# EAGLE design untitled (EAGLE 7.7.0)
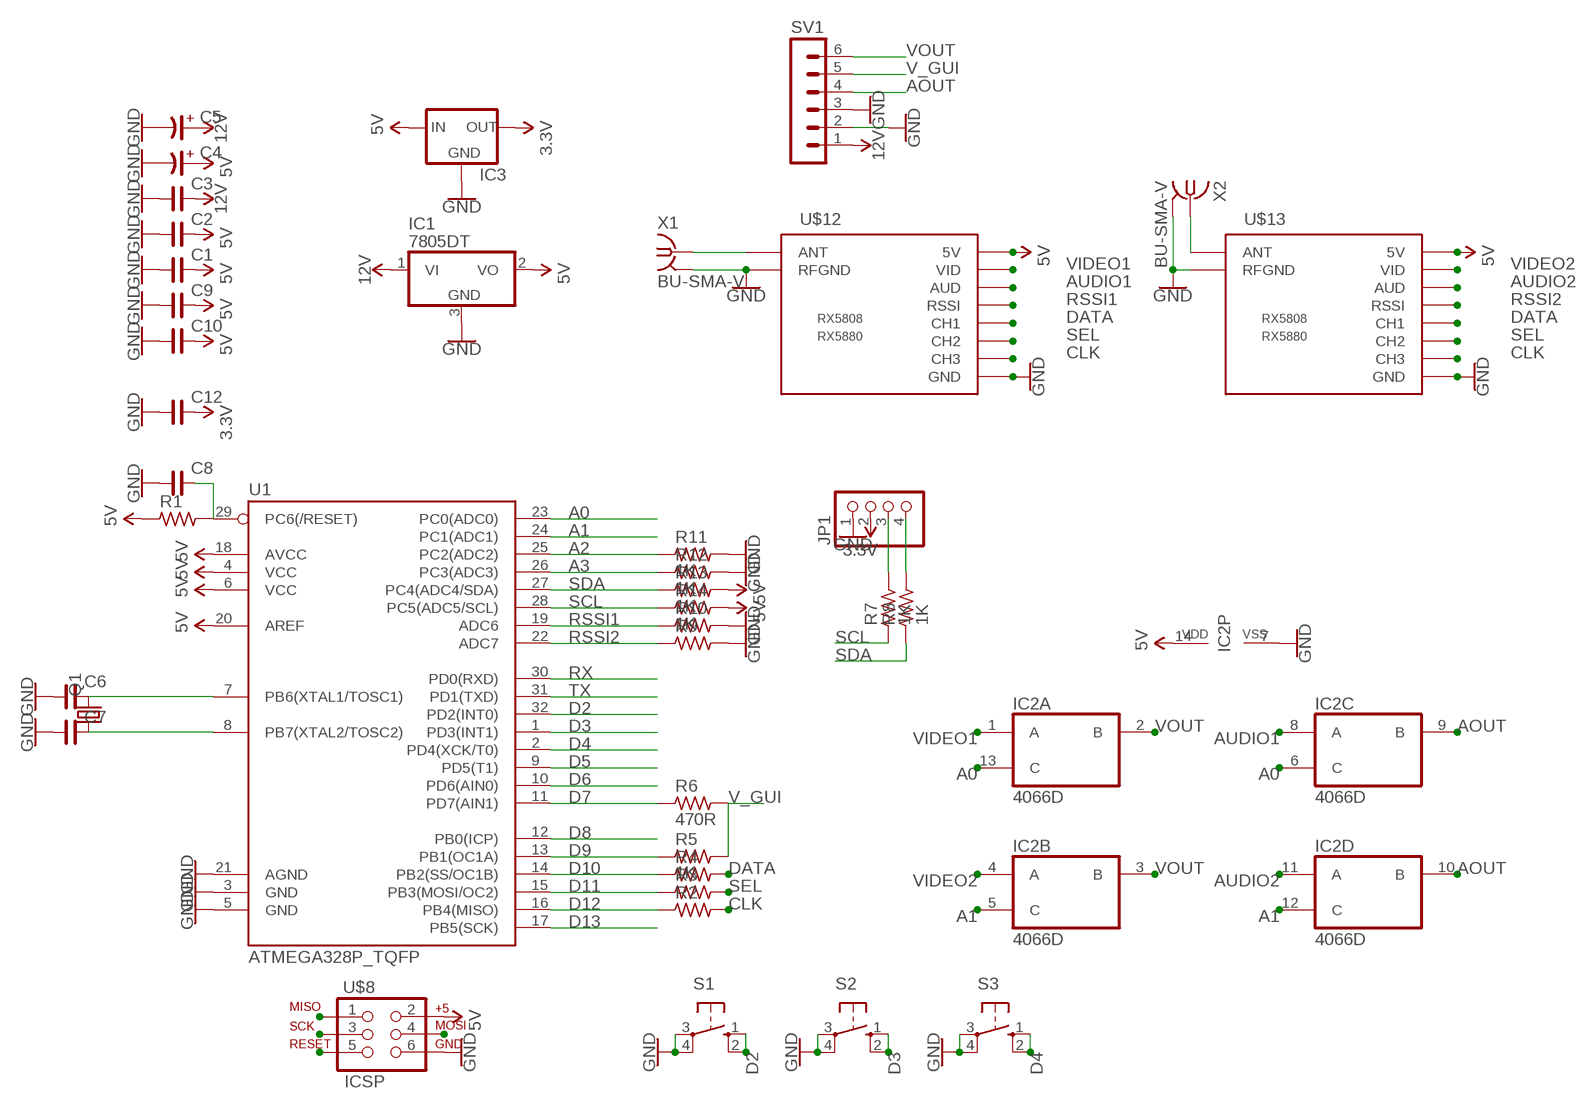
[diagram p0: schematic, sheet 1]

## Parts
C1  C_0805  [C0805]
C2  C_0805  [C0805]
C3  C_0805  [C0805]
C4  CP_6032-28  [C6032-28/T]
C5  CP_6032-28  [C6032-28/T]
C6  C_0805  [C0805]
C7  C_0805  [C0805]
C8  C_0805  [C0805]
C9  C_0805  [C0805]
C10  C_0805  [C0805]
C12  C_0805  [C0805]
IC1  7805DT  [TO252]
IC2  4066D  [SO14]
IC3  LM1117  [SOT223]
JP1  PINHD-1X04_2.54-S  [1X04-S]
Q1  CRYSTALHC49S  [HC49/S]
R1  R_0805  [R0805]
R2  R_0805  [R0805]
R3  R_0805  [R0805]
R4  R_0805  [R0805]
R5  1K  R_0805  [R0805]
R6  470R  R_0805  [R0805]
R7  1K  R_0805  [R0805]
R8  1K  R_0805  [R0805]
R9  R_0805  [R0805]
R10  R_0805  [R0805]
R11  1K  R_0805  [R0805]
R12  1K  R_0805  [R0805]
R13  1K  R_0805  [R0805]
R14  1K  R_0805  [R0805]
S1  10-XX  [B3F-10XX]
S2  10-XX  [B3F-10XX]
S3  10-XX  [B3F-10XX]
SV1  MA06-1  [MA06-1]
U1  ATMEGA328P_TQFP  [TQFP32-08]
U$8  ICSP  AVR_SPI_PRG_6NS  [2X3-NS]
U$12  RX5808  [RX5808]
U$13  RX5808  [RX5808]
X1  BU-SMA-V  [BU-SMA-V]
X2  BU-SMA-V  [BU-SMA-V]

## Nets
3.3V: C12.2 IC3.2(OUT) JP1.2
5V: C1.2 C2.2 C4.+ C9.2 C10.2 IC1.2(VO) IC2.14(P:VDD) IC3.3(IN) R1.1 R13.2 R14.2 U1.4(VCC) U1.6(VCC) U1.18(AVCC) U1.20(AREF) U$8.2 U$12.VCC(5V) U$13.VCC(5V)
12V: C3.2 C5.+ IC1.1(VI) SV1.1
A0: IC2.6(C:C) IC2.13(A:C) U1.23(PC0(ADC0))
A1: IC2.5(B:C) IC2.12(D:C) U1.24(PC1(ADC1))
A2: R11.1 U1.25(PC2(ADC2))
A3: R12.1 U1.26(PC3(ADC3))
AOUT: IC2.9(C:B) IC2.10(D:B) SV1.4
AUDIO1: IC2.8(C:A) U$12.AUD
AUDIO2: IC2.11(D:A) U$13.AUD
CLK: R2.2 U$12.CH3 U$13.CH3
D2: S1.1(S) S1.2(S1) U1.32(PD2(INT0))
D3: S2.1(S) S2.2(S1) U1.1(PD3(INT1))
D4: S3.1(S) S3.2(S1) U1.2(PD4(XCK/T0))
D5: U1.9(PD5(T1))
D6: U1.10(PD6(AIN0))
D7: R6.1 U1.11(PD7(AIN1))
D8: U1.12(PB0(ICP))
D9: R5.1 U1.13(PB1(OC1A))
D10: R4.1 U1.14(PB2(SS/OC1B))
D11: R3.1 U1.15(PB3(MOSI/OC2)) U$8.4
D12: R2.1 U1.16(PB4(MISO)) U$8.1
D13: U1.17(PB5(SCK)) U$8.3
DATA: R4.2 U$12.CH1 U$13.CH1
GND: C1.1 C2.1 C3.1 C4.- C5.- C6.1 C7.1 C8.1 C9.1 C10.1 C12.1 IC1.3(GND) IC2.7(P:VSS) IC3.1(GND) JP1.1 R9.2 R10.2 R11.2 R12.2 S1.3(P) S1.4(P1) S2.3(P) S2.4(P1) S3.3(P) S3.4(P1) SV1.2 SV1.3 U1.3(GND) U1.5(GND) U1.21(AGND) U$8.6 U$12.GND@1(GND) U$12.GND@2(GND) U$12.RFGND@1(RFGND) U$12.RFGND@2(RFGND) U$13.GND@1(GND) U$13.GND@2(GND) U$13.RFGND@1(RFGND) U$13.RFGND@2(RFGND) X1.2 X1.3 X1.4 X1.5 X2.2 X2.3 X2.4 X2.5
N$1: JP1.3 R7.2
N$2: C6.2 Q1.2 U1.7(PB6(XTAL1/TOSC1))
N$3: C7.2 Q1.1 U1.8(PB7(XTAL2/TOSC2))
N$4: JP1.4 R8.2
N$5: U$12.ANT X1.1
N$7: U$13.ANT X2.1
RSSI1: R10.1 U1.19(ADC6) U$12.RSSI
RSSI2: R9.1 U1.22(ADC7) U$13.RSSI
RST: C8.2 R1.2 U1.29(PC6(/RESET)) U$8.5
RX: U1.30(PD0(RXD))
SCL: R7.1 R14.1 U1.28(PC5(ADC5/SCL))
SDA: R8.1 R13.1 U1.27(PC4(ADC4/SDA))
SEL: R3.2 U$12.CH2 U$13.CH2
TX: U1.31(PD1(TXD))
V_GUI: R5.2 R6.2 SV1.5
VIDEO1: IC2.1(A:A) U$12.VID
VIDEO2: IC2.4(B:A) U$13.VID
VOUT: IC2.2(A:B) IC2.3(B:B) SV1.6

## Library data of the parts
C1-C3 C6-C10 C12 = Acap_BNM:C_: NON-POLARIZED CAP
C4 C5 = Acap_BNM:CP_: POLARIZED CAP
IC1 = gm-regulators:78*: Positive VOLTAGE REGULATOR Source: http://cache.national.com/ds/LM/LM78L05.pdf http://www.fairchildsemi.com/ds/LM/LM7805.pdf
IC2 = 40xx:4066: Quad bilateral ANALOG SWITCH
IC3 = v-reg-3:LM1117
JP1 = pinhead-2:PINHD-1X04: PIN HEADER
Q1 = adafruit:CRYSTAL: CRYSTAL; OC_FARNELL: 1667008; OC_NEWARK: unknown
R1-R14 = Acap_BNM:R_: RESISTOR
S1-S3 = switch-omron:10-XX: OMRON SWITCH; MPN: B3F-1000; OC_FARNELL: 176432; OC_NEWARK: 36M3542
SV1 = con-lstb:MA06-1: PIN HEADER; OC_FARNELL: unknown; OC_NEWARK: unknown
U1 = SparkFun-IC-Microcontroller:ATMEGA328P_TQFP: Popular 328P in QFP Storefront component: ATmega328 - TQFP <https://www.sparkfun.com/products/13448> (COM-13448) Datasheet <http://www.sparkfun.com/datasheets/Components/SMD/ATMega328.pdf> SparkFun Products SparkFun RedBoard - Programmed with Arduino <https://www.sparkfun.com/products/12757> (DEV-12757) Arduino Pro Mini 328 - 5V/16MHz <https://www.sparkfun.com/products/11113> (DEV-11113) Arduino Pro Mini 328 - 3.3V/8MHz <https://www.sparkfun.com/products/11114> (DEV-11114) SparkFun OpenLog <https://www.sparkfun.com/products/13712> (DEV-13712) SparkFun MicroView - OLED Arduino Module <https://www.sparkfun.com/products/12923> (DEV-12923) SparkFun Digital Sandbox <https://www.sparkfun.com/products/12651> (DEV-12651) SparkFun PicoBoard <https://www.sparkfun.com/products/11888> (WIG-11888) Arduino Fio <https://www.sparkfun.com/products/10116> (DEV-10116) LilyPad Arduino 328 Main Board <https://www.sparkfun.com/products/13342> (DEV-13342) SparkFun RedStick <https://www.sparkfun.com/products/13741> (DEV-13741) LilyPad MP3 <https://www.sparkfun.com/products/11013> (DEV-11013) LilyPad Arduino SimpleSnap <https://www.sparkfun.com/products/10941> (DEV-10941) SparkFun Stepoko <https://www.sparkfun.com/products/13899> (ROB-13899) SparkFun Geiger Counter <https://www.sparkfun.com/products/11345> (SEN-11345) SparkFun EL Sequencer <https://www.sparkfun.com/products/12781> (COM-12781) Arduino Pro 328 - 5V/16MHz <https://www.sparkfun.com/products/10915> (DEV-10915) CryptoCape <https://www.sparkfun.com/products/12773> (DEV-12773) SparkFun IR Thermometer Evaluation Board - MLX90614 <https://www.sparkfun.com/products/10740> (SEN-10740) SparkFun RedBot Mainboard <https://www.sparkfun.com/products/12097> (ROB-12097) Arduino Pro 328 - 3.3V/8MHz <https://www.sparkfun.com/products/10914> (DEV-10914) SparkFun Block for Intel® Edison - Arduino <https://www.sparkfun.com/products/13036> (DEV-13036) SparkFun Simon Says - Surface Mount Soldering Kit <https://www.sparkfun.com/products/10935> (KIT-10935) SparkFun 7-Segment Serial Display - Red <https://www.sparkfun.com/products/11441> (COM-11441) SparkFun 7-Segment Serial Display - White <https://www.sparkfun.com/products/11629> (COM-11629) SparkFun 7-Segment Serial Display - Yellow <https://www.sparkfun.com/products/11443> (COM-11443) SparkFun 7-Segment Serial Display - Kelly Green <https://www.sparkfun.com/products/11440> (COM-11440) SparkFun 7-Segment Serial Display - Blue <https://www.sparkfun.com/products/11442> (COM-11442) SparkFun OpenSegment Serial Display - 20mm (Blue) <https://www.sparkfun.com/products/11647> (COM-11647) SparkFun OpenSegment Serial Display - 20mm (Green) <https://www.sparkfun.com/products/11646> (COM-11646) SparkFun OpenSegment Serial Display - 20mm (White) <https://www.sparkfun.com/products/11648> (COM-11648) SparkFun OpenSegment Serial Display - 20mm (Red) <https://www.sparkfun.com/products/11644> (COM-11644) SparkFun OpenSegment Serial Display - 20mm (Yellow) <https://www.sparkfun.com/products/11645> (COM-11645) SparkFun OpenSegment Shield <https://www.sparkfun.com/products/13190> (DEV-13190); PROD_ID: IC-09069
U$8 = SparkFun:AVR_SPI_PRG_6: AVR ISP 6 Pin This is the reduced ISP connector for AVR programming. Common on Arduino. This footprint will take up less PCB space and can be used with a 10-pin to 6-pin adapter such as SKU: BOB-08508
U$12 U$13 = 5G8_fpv:RX5808
X1 X2 = con-coax:BU-SMA-V: FEMALE SMA CONNECTOR Radiall distributor RS 112-3794; OC_FARNELL: unknown; OC_NEWARK: unknown

## Board
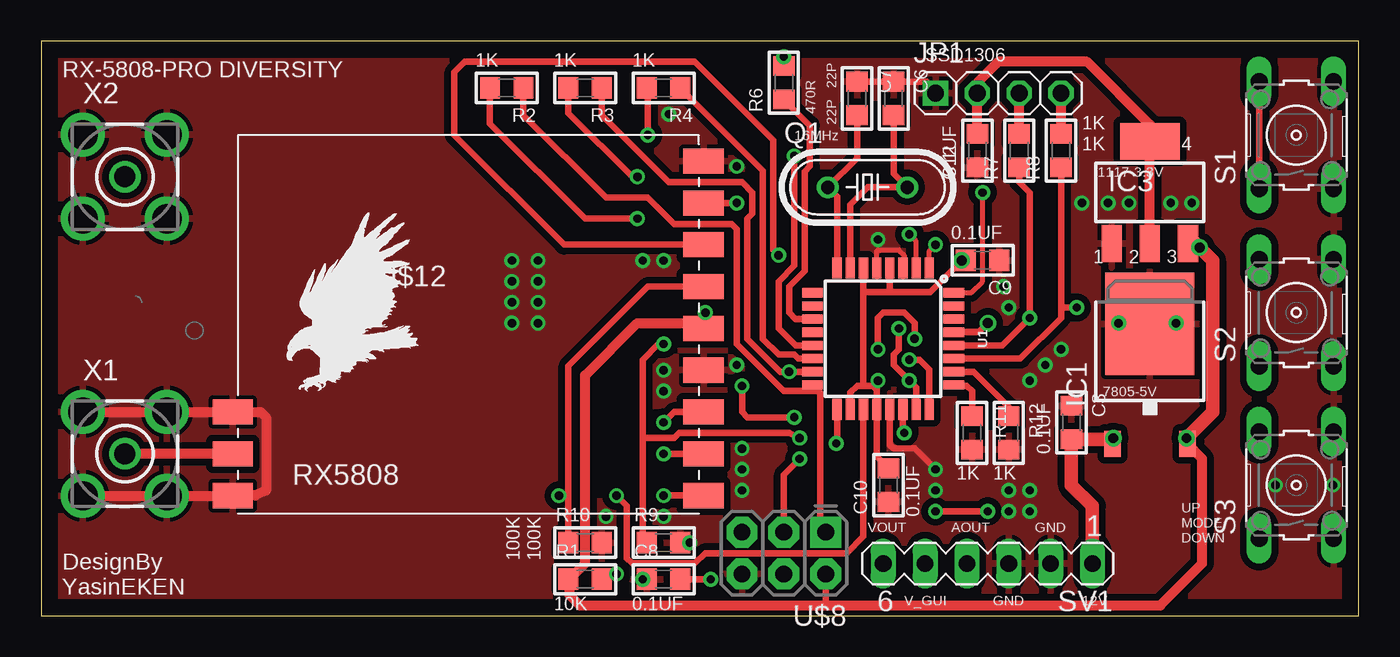
[diagram p1: board, top side]
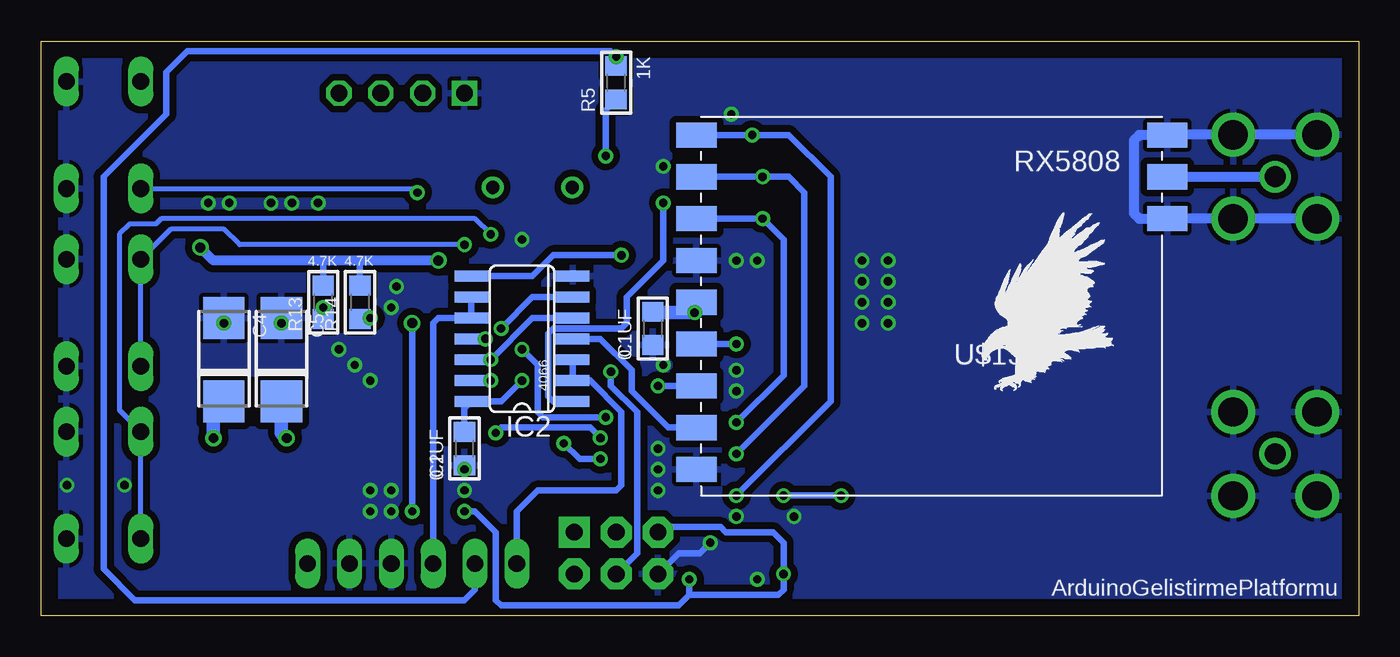
[diagram p2: board, bottom side, seen from below]

Size 79.99 x 34.91 mm. Coordinates in mm from the lower left corner, seen from the top.
Outline: 0,0 79.99,0 79.99,34.91 0,34.91 0,0
Copper layers (1*16): Top 0.035mm / dielectric 1.5mm / Bottom 0.035mm
Design rules "default": minimum track width 10mil, minimum drill 24mil, track to track 8mil, track to pad 8mil, pad to pad 8mil, via to via 8mil, smd to smd 8mil, copper to edge 40mil, drill to drill 8mil, minimum pad ring 10mil, minimum via ring 8mil, stop-mask expansion 4mil, vias tented up to drill 0mil, thermal gap 10mil

### Footprints (pad centres in the part's own frame; a part is rotated, then mirrored left to right if it is on the bottom)
C0805 = smd 1.2 x 1.3: 1 -1.016,0; 2 1.016,0
C6032-28/T = smd 2.55 x 2.5: + 2.54,0; - -2.54,0
TO252 = smd 1 x 1.6: 1 -2.28,-4.8; 2 2.28,-4.8 | smd 5.4 x 6.2: 3 0,2.5
SO14 = smd 0.66 x 2.032: 1 -3.81,-3.073; 2 -2.54,-3.073; 3 -1.27,-3.073; 4 0,-3.073; 5 1.27,-3.073; 6 2.54,-3.073; 7 3.81,-3.073; 8 3.81,3.073; 9 2.54,3.073; 10 1.27,3.073; 11 0,3.073; 12 -1.27,3.073; 13 -2.54,3.073; 14 -3.81,3.073
SOT223 = smd 1.219 x 2.235: 1 -2.311,-3.099; 2 0,-3.099; 3 2.311,-3.099 | smd 3.6 x 2.2: 4 0,3.099
1X04-S = drill 1.016 square: 1 -3.81,0 | drill 1.016 octagon: 2 -1.27,0; 3 1.27,0; 4 3.81,0
HC49/S = drill 0.813: 1 -2.413,0; 2 2.413,0
R0805 = smd 1.2 x 1.3: 1 -1.016,0; 2 1.016,0
B3F-10XX = drill 1.016 long: 1 -3.251,2.261; 2 3.251,2.261; 3 -3.251,-2.261; 4 3.251,-2.261
MA06-1 = drill 1.016 long: 1 -6.35,0; 2 -3.81,0; 3 -1.27,0; 4 1.27,0; 5 3.81,0; 6 6.35,0
TQFP32-08 = smd 1.27 x 0.559: 1 -4.293,2.8; 2 -4.293,2; 3 -4.293,1.2; 4 -4.293,0.4; 5 -4.293,-0.4; 6 -4.293,-1.2; 7 -4.293,-2; 8 -4.293,-2.8; 17 4.293,-2.8; 18 4.293,-2; 19 4.293,-1.2; 20 4.293,-0.4; 21 4.293,0.4; 22 4.293,1.2; 23 4.293,2; 24 4.293,2.8 | smd 0.559 x 1.27: 9 -2.8,-4.293; 10 -2,-4.293; 11 -1.2,-4.293; 12 -0.4,-4.293; 13 0.4,-4.293; 14 1.2,-4.293; 15 2,-4.293; 16 2.8,-4.293; 25 2.8,4.293; 26 2,4.293; 27 1.2,4.293; 28 0.4,4.293; 29 -0.4,4.293; 30 -1.2,4.293; 31 -2,4.293; 32 -2.8,4.293
2X3-NS = drill 1.016 pad 1.88 square: 1 -2.54,-1.27 | drill 1.016 pad 1.88 octagon: 2 -2.54,1.27; 3 0,-1.27; 4 0,1.27; 5 2.54,-1.27; 6 2.54,1.27
RX5808 = smd 2.438 x 1.524: ANT -15.037,-7.62; AUD 13.538,5.08; CH1 13.538,-10.16; CH2 13.538,-7.62; CH3 13.538,-5.08; GND@1 13.538,10.16; GND@2 13.538,-2.54; RFGND@1 -15.037,-5.08; RFGND@2 -15.037,-10.16; RSSI 13.538,2.54; VCC 13.538,0; VID 13.538,7.62
BU-SMA-V = drill 1.27: 1 0,0 | drill 1.778: 2 -2.55,2.55; 3 2.55,2.55; 4 2.55,-2.55; 5 -2.55,-2.55

### Placement (x,y rotation side)
C1  42.86,17.46 90 bottom
C2  54.29,10.16 90 bottom
C3  62.55,11.75 270 top
C4  68.9,15.56 270 bottom
C5  65.41,15.56 270 bottom
C6  51.75,31.43 270 top
C7  49.53,31.43 270 top
C8  37.78,2.22 0 top
C9  57.15,21.59 180 top
C10  51.44,7.94 90 top
C12  56.83,28.26 90 top
IC1  67.31,15.24 0 top
IC2  50.8,16.83 90 bottom
IC3  67.31,25.72 0 top
JP1  58.1,31.75 0 top
Q1  50.16,26.04 0 top
R1  33.02,2.22 0 top
R2  28.26,32.07 180 top
R3  33.02,32.07 180 top
R4  37.78,32.07 180 top
R5  45.09,32.38 90 bottom
R6  45.09,32.38 90 top
R7  59.37,28.26 90 top
R8  61.91,28.26 90 top
R9  37.78,4.45 0 top
R10  33.02,4.45 0 top
R11  56.52,11.11 270 top
R12  58.74,11.11 270 top
R13  62.87,19.05 90 bottom
R14  60.64,19.05 90 bottom
S1  76.2,29.21 90 top
S2  76.2,18.41 90 top
S3  76.2,7.94 90 top
SV1  57.47,3.17 180 top
U1  51.12,16.83 270 top
U$8  45.09,3.81 180 top
U$10  [LOGO]  1.91,16.83 0 top
U$12  26.67,17.46 0 top
U$13  26.67,19.05 180 bottom
U$19  [EAGLE-PLC-8MM]  14.92,13.65 0 top
U$20  [EAGLE-PLC-8MM]  22.86,13.65 0 bottom
X1  5.08,9.84 0 top
X2  5.08,26.67 0 top

### Tracks (layer width: path | path; a pad name or v marks a point on that pad's centre or on a via)
3.3V
  Top 0.61: IC3.2 67.31,29.84 63.5,33.66 58.1,33.66 56.83,32.38 JP1.2 | C12.2 JP1.2 | JP1.2 56.83,31.91
5V  (via drill 0.5, 0.6)
  Top 0.406: U1.20 50.72,13.73 50.48,13.97 49.92,13.97 | 49.92,13.97 49.53,13.97 49.12,13.56 U1.18 | U1.6 49.92,19.68 | 49.92,19.68 49.92,13.97 | C10.2 50.72,9.67 U1.20 | C9.2 56.13,21.65 | v50.8,14.29 50.72,14.21 U1.20 | 32.07,2.22 R1.1 | U$8.2 47.62,0.64 | 55.94,21.65 53.98,19.68 51.44,19.68 | 51.44,19.68 49.92,19.68 | U1.4 51.52,19.77 51.44,19.68
  Top 0.61: 69.53,22.53 IC3.3 69.86,22.38 v70.33,22.38 | v55.88,21.59 C9.2 | 56.13,21.65 55.94,21.65 | IC1.2 70.48,9.54 70.48,3.17 67.94,0.64 47.62,0.64 32.7,0.64 32.07,1.27 32.07,2.22 33.02,3.17 33.02,14.61 36.2,17.78 39.69,17.78 40.01,17.46 U$12.VCC
  Top 0.813: U$12.VCC 40.32,17.58 v40.32,18.41 | IC1.2 69.59,10.74 v69.53,10.79 71.12,12.38 71.12,21.59 v70.33,22.38 70.09,22.62 IC3.3
  Bottom 0.406: v50.8,14.29 52.07,13.02 IC2.14 54.29,12.6 C2.2 | R14.2 60.64,21.59 | R13.2 62.87,21.59
  Bottom 0.61: v55.88,21.59 60.64,21.59 62.87,21.59 69.53,21.59 v70.33,22.38
  Bottom 0.813: U$13.VCC 40.21,18.53 v40.32,18.41 42.8,18.41 C1.2 | v69.53,10.79 69.53,12.38 C4.+
12V  (via drill 0.6)
  Top 0.813: SV1.1 63.82,6.67 62.55,7.94 C3.2 65,10.73 IC1.1 65.09,10.18 v65.09,10.79
  Bottom 0.813: C5.+ 65.41,11.11 v65.09,10.79
A0  (via drill 0.5)
  Top 0.406: U1.23 53.12,13.88 v52.7,14.29 51.75,15.24 51.75,15.88 52.07,16.19 v52.07,17.46
  Bottom 0.406: v52.7,14.29 IC2.13 | IC2.6 50.16,19.37 v52.07,17.46
A1  (via drill 0.5)
  Top 0.406: U1.24 53.92,14.98 53.34,15.56 v52.7,15.56
  Bottom 0.406: IC2.12 v52.7,15.56 50.16,18.1 IC2.5
A2
  Top 0.406: R11.1 56.52,13.65 56.2,13.97 55.47,13.97 U1.25
A3
  Top 0.406: R12.1 58.74,12.7 56.61,14.83 U1.26
AOUT
  Bottom 0.406: IC2.9 IC2.10 55.88,18.1 56.2,17.78 SV1.4
AUDIO1  (via drill 0.5)
  Top 0.406: U$12.AUD 31.75,22.54 25.08,29.21 25.08,33.02 25.72,33.66 39.69,33.66 44.45,28.89 44.45,22.23 v44.77,21.91
  Bottom 0.406: IC2.8 50.16,20.64 48.9,21.91 v44.77,21.91
AUDIO2  (via drill 0.5)
  Top 0.406: v53.02,16.83 53.02,17.78 52.39,18.41 51.12,18.41 50.8,18.1 v50.8,16.19 | v42.55,13.97 42.55,12.38 42.86,12.06 v45.72,12.06
  Bottom 0.406: IC2.11 v53.02,16.83 | v50.8,16.19 49.85,15.24 49.85,12.38 49.53,12.06 v45.72,12.06 | U$13.AUD v42.55,13.97
CLK  (via drill 0.5)
  Top 0.406: R2.2 27.24,29.91 33.02,24.13 v36.2,24.13 | U$12.CH3 38.42,12.38 v37.78,11.75
  Bottom 0.406: U$13.CH3 v36.2,24.13 34.92,22.86 34.92,14.61 v37.78,11.75
D2  (via drill 0.5)
  Top 0.305: U1.32 56.46,19.63 57.15,20.32 v57.15,25.72
  Top 0.406: S1.2 S1.1
  Bottom 0.305: S1.1 57.39,25.96 v57.15,25.72
D3  (via drill 0.5)
  Top 0.305: U1.1 53.92,22.17 v54.29,22.54
  Bottom 0.305: v54.29,22.54 67.94,22.54 68.9,23.5 72.11,23.5 S2.2 S2.1
D4  (via drill 0.5)
  Top 0.305: U1.2 53.12,22.77 v52.7,23.18
  Bottom 0.305: v52.7,23.18 53.66,24.13 72.71,24.13 73.03,23.81 74.61,23.81 75.25,23.18 75.25,12.5 S3.2 S3.1
D7
  Top 0.406: U1.11 45.79,18.03 45.4,18.41 45.4,20 46.35,20.95 46.35,26.99 46.67,27.3 46.67,29.78 R6.1
D9  (via drill 0.5)
  Top 0.406: U1.13 45.8,16.43 44.77,17.46 44.77,20.32 45.72,21.27 v45.72,27.94
  Bottom 0.406: v45.72,27.94 45.72,30.73 R5.1
D10
  Top 0.406: R4.1 43.81,27.05 43.81,16.83 44.77,15.88 45.72,15.88 45.97,15.63 U1.14
D11  (via drill 0.5)
  Top 0.406: U1.15 v45.4,14.83 44.86,14.83 42.86,16.83 42.86,24.13 43.18,24.45 43.18,25.72 42.55,26.35 38.1,26.35 34.04,30.42 R3.1
  Bottom 0.406: v45.4,14.83 45.4,13.97 43.81,12.38 43.81,3.81 U$8.4
D12
  Top 0.406: R2.1 29.27,30.42 34.29,25.4 36.83,25.4 38.42,23.81 41.91,23.81 42.23,23.5 42.23,16.51 45.09,13.65 47.2,13.65 | U$8.1 47.31,5.4 47.31,13.54 47.2,13.65 | 47.2,13.65 U1.16
D13  (via drill 0.5)
  Top 0.406: U$8.3 45.09,8.57 v46.04,9.53 | v48.26,10.48 48.32,10.54 U1.17
  Bottom 0.406: v46.04,9.53 47.31,9.53 v48.26,10.48
DATA  (via drill 0.5)
  Top 0.406: U$12.CH1 v37.78,7.3 | R4.2 36.83,32 v36.83,29.21
  Bottom 0.406: U$13.CH1 v36.83,29.21 34.61,29.21 32.07,26.67 32.07,13.02 v37.78,7.3
GND  (via drill 0.5)
  Top 0.305: U1.5 50.72,22.14 50.8,22.23 52.07,22.23 52.39,21.91 52.39,21.19 U1.3
  Top 0.406: C7.1 C6.1 53.75,32.45 | U1.21 51.52,10.39 51.75,10.16 53.02,10.16 v54.29,8.89 | v39.37,4.45 R9.2
  Top 0.61: X1.2 X1.3 11.62,12.39 U$12.RFGND@1 13.34,12.38 13.65,12.06 13.65,7.62 13.02,7.3 U$12.RFGND@2 X1.4 X1.5
  Bottom 0.406: U$8.6 41.27,3.81 40.01,3.81 v39.37,4.45
  Bottom 0.61: X2.2 X2.3 U$13.RFGND@2 13.34,29.21 13.65,28.89 13.65,24.45 13.34,24.13 U$13.RFGND@1 X2.4 X2.5
  other vias: 65.41,17.78 68.9,17.78 74.93,7.94 78.42,7.94 37.78,14.92 37.78,13.65 42.23,15.24 42.55,8.89 42.55,10.16 42.55,7.62 36.51,2.22 34.29,6.03 37.78,21.59 36.51,21.59 38.1,30.48 42.23,27.3 60.96,15.24 63.18,25.08 66.04,25.08 68.58,25.08 69.85,25.08 64.77,25.08 58.42,20 54.29,7.62 30.16,21.59 30.16,20.32 30.16,19.05 30.16,17.78 28.57,17.78 28.57,19.05 28.57,20.32 28.57,21.59 37.78,6.03 58.74,18.73 60.01,6.35 60.01,14.29 61.91,16.19 60.01,7.62 58.74,7.62 58.74,6.35 50.8,22.86
  pour Bottom (isolate 0.406): 0,0 80.01,0 80.01,34.92 0,34.92
  pour Top (isolate 0.406): 0,0 80.01,0 80.01,34.92 0,34.92
N$1
  Top 0.61: R7.2 JP1.3
N$2
  Top 0.406: U1.7 49.12,24.99 50.16,26.04 Q1.2 51.75,26.86 C6.2
N$3
  Top 0.406: U1.8 48.32,25.47 Q1.1 49.53,27.81 C7.2
N$4
  Top 0.61: R8.2 JP1.4
N$5
  Top 0.61: U$12.ANT X1.1
N$7
  Bottom 0.61: U$13.ANT X2.1
RSSI1  (via drill 0.5)
  Top 0.406: R10.1 32,7.3 | 32,7.3 32,15.18 36.83,20 U$12.RSSI | U1.19 49.92,4.83 48.9,3.81 40.32,3.81 39.69,3.17 35.88,3.17 35.56,3.49 35.56,6.67 v34.92,7.3 | v31.43,7.3 32,7.3
  Bottom 0.406: v34.92,7.3 v31.43,7.3
RSSI2  (via drill 0.5)
  Top 0.406: R9.1 36.51,4.7 36.51,10.79 | 36.51,10.79 36.51,15.56 37.47,16.51 v37.78,16.51 | U1.22 52.32,11.18 v52.39,11.11 | v46.04,10.79 45.4,11.11 38.73,11.11 38.42,10.79 36.51,10.79
  Bottom 0.406: v37.78,16.51 U$13.RSSI | v52.39,11.11 52.07,11.43 46.67,11.43 v46.04,10.79
RST  (via drill 0.5, 0.6)
  Top 0.406: U1.29 56.91,17.23 v57.47,17.78 | C8.2 v40.64,2.22 | R1.2 v34.92,2.54 | v57.47,6.35 v54.29,6.35
  Bottom 0.406: 40.64,1.27 v40.64,2.22 | 40.64,1.27 35.24,1.27 34.92,1.59 v34.92,2.54 34.92,4.45 35.56,5.08 38.42,5.08 38.73,5.4 42.23,5.4 U$8.5 | v57.47,17.78 v57.47,6.35 | v54.29,6.35 53.66,6.35 52.39,5.08 52.39,0.95 52.07,0.64 41.27,0.64 40.64,1.27
SCL  (via drill 0.5)
  Top 0.406: U1.28 58.34,16.43 v60.01,18.1 60.01,25.72 59.37,26.35 R7.1
  Bottom 0.406: R14.1 60.9,18.1 v60.01,18.1
SDA  (via drill 0.5)
  Top 0.406: U1.27 59.44,15.63 61.91,18.1 61.91,18.73 | 61.91,18.73 R8.1 | v62.87,18.73 61.91,18.73
  Bottom 0.406: R13.1 v62.87,18.73
SEL  (via drill 0.5)
  Top 0.406: R3.2 32,30.54 35.88,26.67 v36.2,26.67 | U$12.CH2 v37.78,9.84
  Bottom 0.406: U$13.CH2 v36.2,26.67 34.61,26.67 33.66,25.72 33.66,13.97 v37.78,9.84
V_GUI  (via drill 0.5)
  Top 0.406: R6.2 v45.09,33.97
  Bottom 0.406: R6.2 v45.09,33.97 45.4,34.29 71.12,34.29 72.39,33.02 72.39,30.48 76.2,26.67 76.2,2.86 74.3,0.95 54.29,0.95 53.66,1.59 SV1.5
VIDEO1  (via drill 0.5)
  Top 0.406: v42.23,25.08 U$12.VID
  Bottom 0.406: IC2.1 48.9,13.02 49.21,13.34 49.21,17.14 48.9,17.46 44.77,17.46 44.45,17.78 44.45,19.37 42.23,21.59 v42.23,25.08
VIDEO2
  Bottom 0.406: IC2.4 46.04,16.83 44.13,14.92 44.13,13.65 41.91,11.43 U$13.VID
VOUT
  Bottom 0.406: IC2.3 IC2.2 46.67,14.29 44.77,12.38 44.77,7.94 45.09,7.62 49.85,7.62 51.12,6.35 SV1.6

### Text on the board
tPlace: SSD1306 | RX-5808-PRO DIVERSITY | 1K | 1K | 1K | 22P | 470R | 22P | 1K | 16MHz | 1K | 0.1UF | 1117-3.3V | 0.1UF | 7805-5V | 0.1UF | RX5808 | 1K | 1K | 100K | 100K | 0.1UF | VOUT | AOUT | GND | UP / MODE / DOWN | DesignBy / YasinEKEN | V_GUI | GND | 12V | 10K | 0.1UF
bPlace: 1K | RX5808 | 4.7K | 4.7K | 0.1UF | 4066 | 0.1UF | ArduinoGelistirmePlatformu